# EAGLE design E4PRJ4PSU (EAGLE 7.1.0)
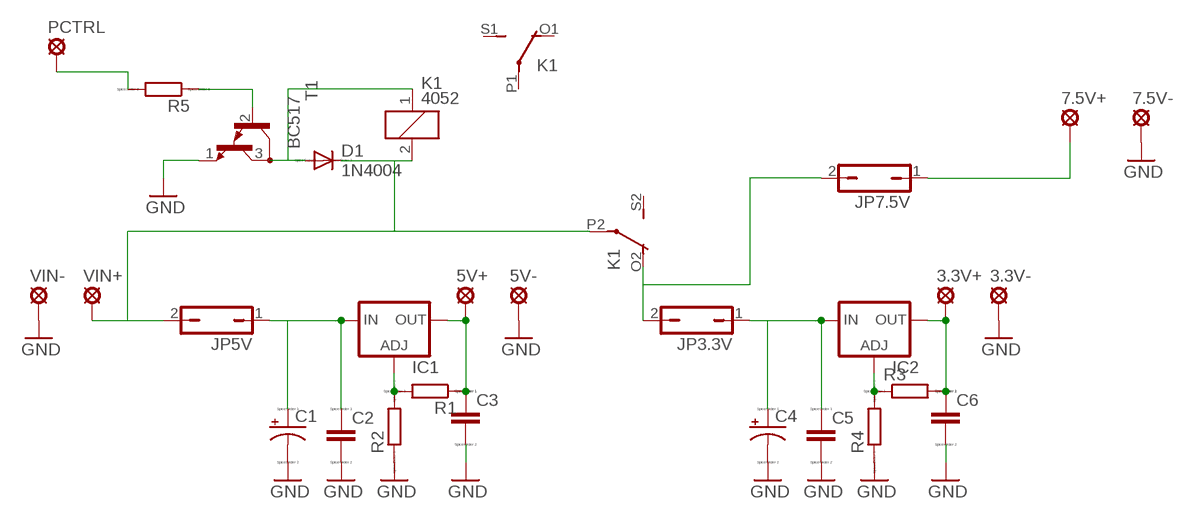
[diagram p0: schematic, sheet 1]

## Parts
3.3V+  SE14  [SE14]
3.3V-  SE14  [SE14]
5V+  SE14  [SE14]
5V-  SE14  [SE14]
7.5V+  SE14  [SE14]
7.5V-  SE14  [SE14]
C1  CPOL-USE5-10.5  [E5-10,5]
C2  C-EU050-025X075  [C050-025X075]
C3  C-EU050-025X075  [C050-025X075]
C4  CPOL-USE5-10.5  [E5-10,5]
C5  C-EU050-025X075  [C050-025X075]
C6  C-EU050-025X075  [C050-025X075]
D1  1N4004  [DO41-10]
IC1  LM317TS  [317TS]
IC2  LM317TS  [317TS]
JP3.3V  JP1Q  [JP1]
JP5V  JP1Q  [JP1]
JP7.5V  JP1Q  [JP1]
K1  4052  [F4052]
PCTRL  SE14  [SE14]
R1  R-EU_0207_10  [0207/10]
R2  R-EU_0207_10  [0207/10]
R3  R-EU_0207_10  [0207/10]
R4  R-EU_0207_10  [0207/10]
R5  R-EU_0207_10  [0207/10]
T1  BC517  [TO92]
VIN+  SE14  [SE14]
VIN-  SE14  [SE14]

## Nets
5V: JP3.3V.2 JP7.5V.2 K1.O2(3:O)
GND: 3.3V-.MP 5V-.MP 7.5V-.MP C1.- C2.2 C3.2 C4.- C5.2 C6.2 R2.1 R4.1 T1.1(E) VIN-.MP
N$1: C1.+ C2.1 IC1.3(IN) JP5V.1
N$2: 5V+.MP C3.1 IC1.2(OUT) R1.1
N$3: IC1.1(ADJ) R1.2 R2.2
N$4: C4.+ C5.1 IC2.3(IN) JP3.3V.1
N$5: IC2.1(ADJ) R3.1 R4.2
N$6: 3.3V+.MP C6.1 IC2.2(OUT) R3.2
N$8: PCTRL.MP R5.2
N$9: R5.1 T1.2(B)
N$10: D1.A K1.1 T1.3(C)
N$11: D1.C JP5V.2 K1.2 K1.P2(3:P) VIN+.MP
N$13: 7.5V+.MP JP7.5V.1
Unconnected: K1.O1(2:O) K1.P1(2:P) K1.S1(2:S) K1.S2(3:S)

## Library data of the parts
3.3V+ 3.3V- 5V+ 5V- 7.5V+ 7.5V- PCTRL VIN+ VIN- = solpad:SE14: SOLDER PAD E1553, drill 1,4mm, distributor Buerklin, 07F820
C1 C4 = resistor:CPOL-US: POLARIZED CAPACITOR, American symbol
C2 C3 C5 C6 = resistor:C-EU: CAPACITOR, European symbol; SPICEPREFIX: C
D1 = diode:1N4004: DIODE general purpose rectifier, 1 A
IC1 IC2 = v-reg:LM317TS: VOLTAGE REGULATOR
JP3.3V JP5V JP7.5V = jumper:JP1Q: JUMPER
K1 = relay:4052: RELAY 2 x switch, Finder; OC_FARNELL: unknown; OC_NEWARK: unknown
R1-R5 = resistor:R-EU_: RESISTOR, European symbol; SPICEPREFIX: R
T1 = transistor:BC517: NPN BIPOLAR DARLINGTON TRANSISTOR

## Net classes
0 default: width 0.305 mm, drill 0.508 mm, clearance 0.254 mm
1 IHA: width 0.406 mm, drill 2.159 mm, clearance 0.508 mm

## Board
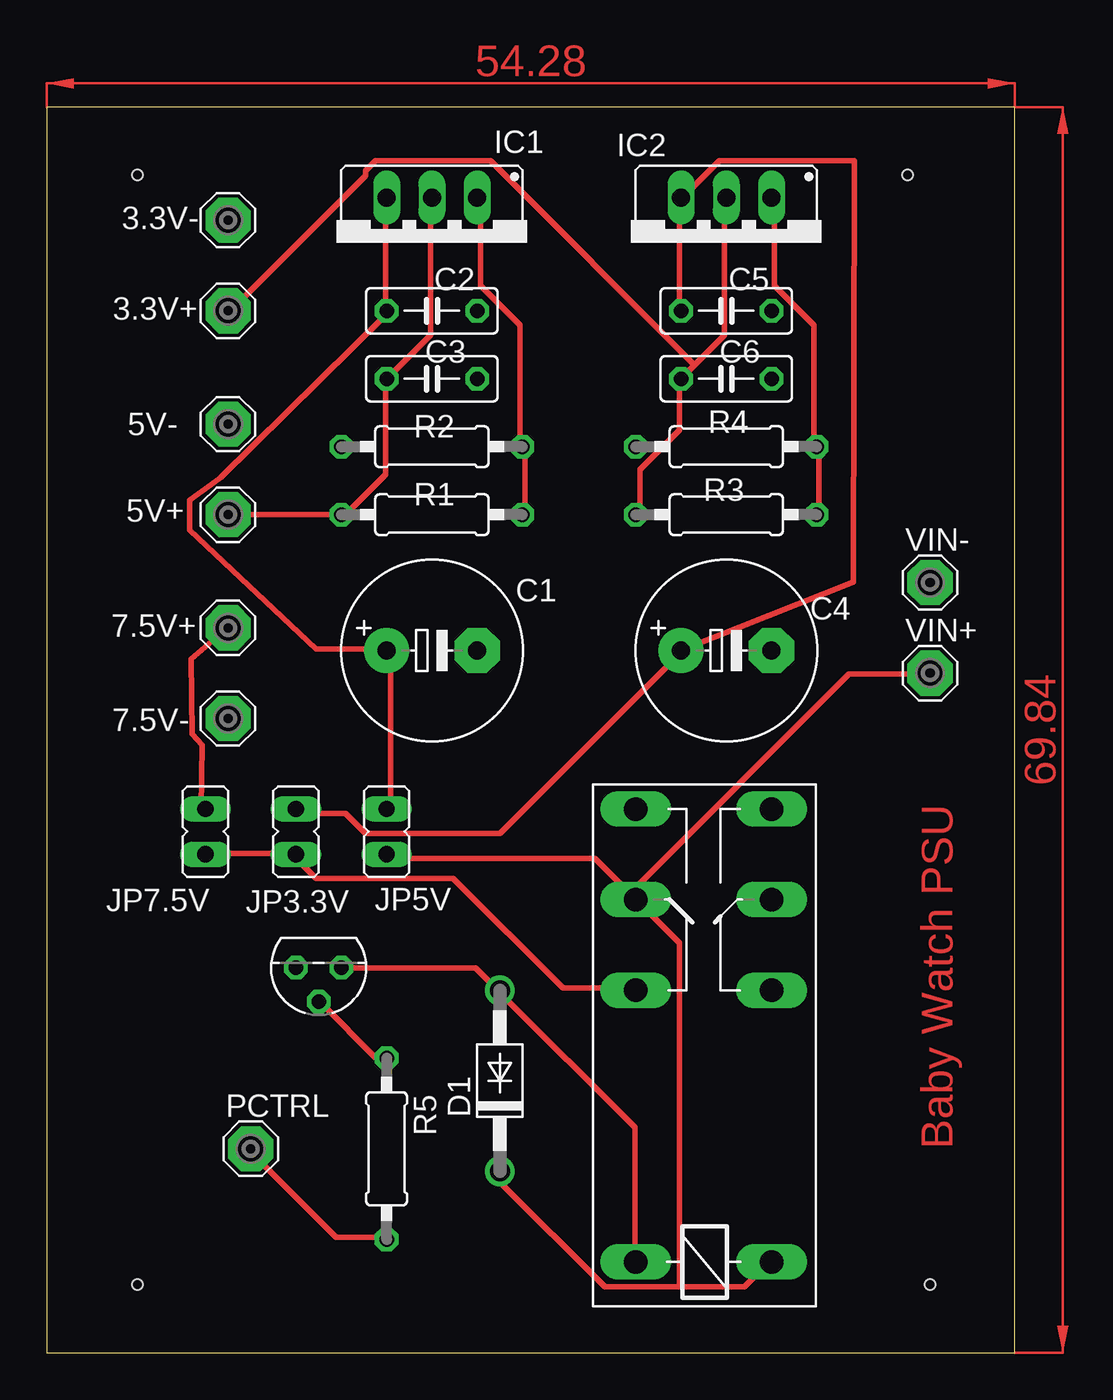
[diagram p1: board, top side]
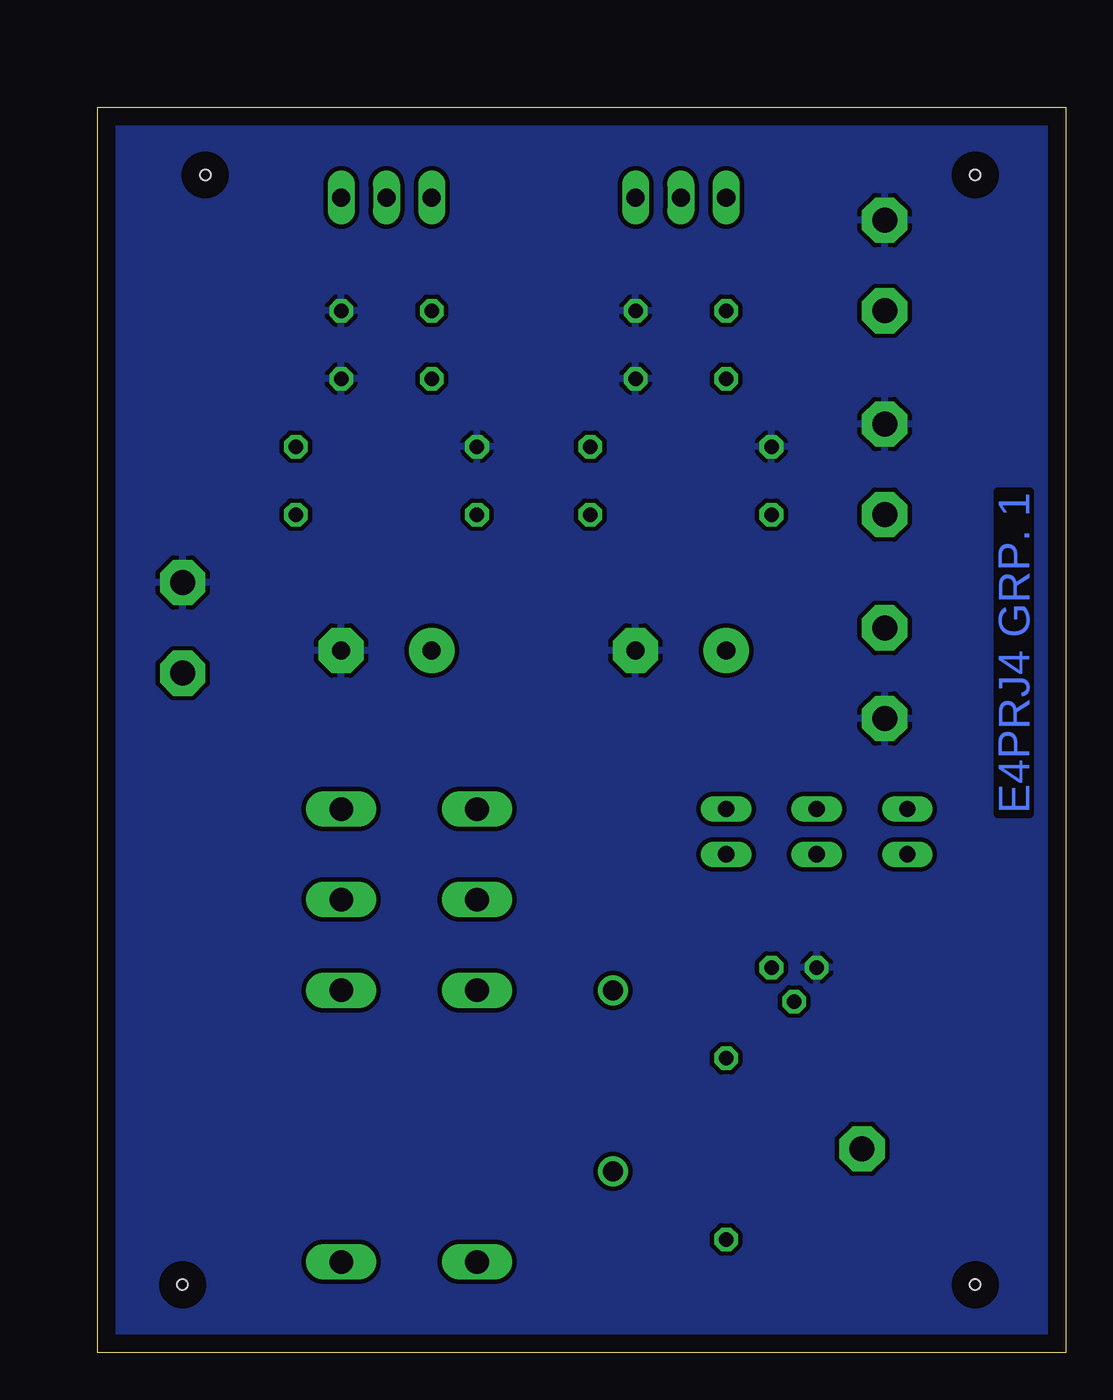
[diagram p2: board, bottom side, seen from below]

Size 54.28 x 69.84 mm. Coordinates in mm from the lower left corner, seen from the top.
Outline: 0,0 54.28,0 54.28,69.84 0,69.84 0,0
Copper layers (1*16): Top 0.035mm / dielectric 1.5mm / Bottom 0.035mm
Design rules "default": minimum track width 10mil, minimum drill 24mil, track to track 8mil, track to pad 8mil, pad to pad 8mil, via to via 8mil, smd to smd 8mil, copper to edge 40mil, drill to drill 8mil, minimum pad ring 10mil, minimum via ring 8mil, stop-mask expansion 4mil, vias tented up to drill 0mil, thermal gap 10mil
Holes 0.6 mm at 5.08,3.81 49.53,3.81 5.08,66.04 48.26,66.04

### Footprints (pad centres in the part's own frame; a part is rotated, then mirrored left to right if it is on the bottom)
SE14 = drill 1.397 pad 2.54 octagon: MP 0,0
E5-10,5 = drill 1.016 pad 2.54: + -2.54,0 | drill 1.016 pad 2.54 octagon: - 2.54,0
C050-025X075 = drill 0.813 octagon: 1 -2.54,0; 2 2.54,0
DO41-10 = drill 1.118: A 5.08,0; C -5.08,0
317TS = drill 1.016 long: 1 -2.54,-2.54; 2 0,-2.54; 3 2.54,-2.54
JP1 = drill 0.914 long: 1 0,-1.27; 2 0,1.27
F4052 = drill 1.321 long: 1 -3.81,3.81; 2 -3.81,-3.81; O1 11.43,-3.81; O2 11.43,3.81; P1 16.51,-3.81; P2 16.51,3.81; S1 21.59,-3.81; S2 21.59,3.81
0207/10 = drill 0.813 octagon: 1 -5.08,0; 2 5.08,0
TO92 = drill 0.813 octagon: 1 1.27,0; 2 0,1.905; 3 -1.27,0

### Placement (x,y rotation side)
3.3V+  10.16,58.42 0 top
3.3V-  10.16,63.5 0 top
5V+  10.16,46.99 0 top
5V-  10.16,52.07 0 top
7.5V+  10.16,40.64 0 top
7.5V-  10.16,35.56 0 top
C1  21.59,39.37 0 top
C2  21.59,58.42 0 top
C3  21.59,54.61 0 top
C4  38.1,39.37 0 top
C5  38.1,58.42 0 top
C6  38.1,54.61 0 top
D1  25.4,15.24 90 top
IC1  21.59,62.23 180 top
IC2  38.1,62.23 180 top
JP3.3V  13.97,29.21 180 top
JP5V  19.05,29.21 180 top
JP7.5V  8.89,29.21 180 top
K1  36.83,8.89 90 top
PCTRL  11.43,11.43 0 top
R1  21.59,46.99 0 top
R2  21.59,50.8 0 top
R3  38.1,46.99 180 top
R4  38.1,50.8 0 top
R5  19.05,11.43 270 top
T1  15.24,21.59 180 top
VIN+  49.53,38.1 0 top
VIN-  49.53,43.18 0 top

### Tracks (layer width: path | path; a pad name or v marks a point on that pad's centre or on a via)
5V
  Top 0.305: JP7.5V.2 8.94,27.99 13.97,27.99 JP3.3V.2 13.97,27.71 15.09,26.59 22.78,26.59 28.93,20.45 32.97,20.45 K1.O2
GND
  pour Bottom: -2.54,72.39 59.69,72.39 58.42,-3.81 -3.81,-3.81
N$1
  Top 0.305: IC1.3 19,64.59 19,58.44 C2.1 19,58.17 9.75,49.07 9.22,48.67 8,47.8 8,46.13 15.09,39.45 19,39.45 C1.+ 19.28,39.17 19.28,30.51 JP5V.1
N$2
  Top 0.305: 5V+.MP R1.1 16.76,46.99 19,49.23 19,54.53 C3.1 19.28,54.81 21.51,57.05 21.51,64.59 IC1.2
N$3
  Top 0.305: R1.2 26.82,46.99 26.82,50.62 R2.2 26.54,50.9 26.54,57.61 24.31,59.84 24.31,64.59 IC1.1
N$4
  Top 0.305: C5.1 35.48,58.44 35.48,64.59 IC2.3 35.76,64.87 37.72,66.83 45.29,66.83 45.24,43.2 35.76,39.45 C4.+ 35.48,39.17 25.42,29.11 17.88,29.11 16.76,30.23 13.97,30.23 JP3.3V.1
N$5
  Top 0.305: R3.1 43.31,46.99 43.31,50.62 R4.2 43.03,50.9 43.03,57.61 40.79,59.84 40.79,64.59 IC2.1
N$6
  Top 0.305: R3.2 33.25,46.99 33.25,49.51 35.48,51.74 35.48,54.53 C6.1 36.32,55.37 | 36.32,55.37 38,57.05 38,64.59 IC2.2 | 36.32,55.37 24.87,66.83 18.44,66.83 17.88,66.27 17.88,65.99 10.34,58.44 3.3V+.MP
N$8
  Top 0.305: R5.2 19,6.48 16.21,6.48 11.46,11.23 PCTRL.MP
N$9
  Top 0.305: R5.1 19,16.54 18.44,16.54 15.37,19.61 T1.2
N$10
  Top 0.305: T1.3 16.76,21.56 24.03,21.56 25.15,20.45 D1.A 25.42,20.17 32.97,12.62 32.97,5.08 K1.1
N$11
  Top 0.305: 35.48,3.68 39.12,3.68 40.51,5.08 K1.2 | 35.48,3.68 31.29,3.68 25.42,9.55 25.42,10.11 D1.C | 32.69,25.76 32.97,25.48 K1.P2 | 32.69,25.76 30.73,27.71 19.28,27.71 JP5V.2 | 32.69,25.76 44.98,38.05 49.45,38.05 VIN+.MP | 32.69,25.76 K1.P2 | 35.48,3.68 35.48,22.96 33.25,25.2 K1.P2
N$13
  Top 0.305: JP7.5V.1 8.66,30.51 8.71,34.06 8.15,34.7 8.1,38.89 10.06,40.56 7.5V+.MP
(copper drawn outside any net)
  shapes: Top area x2

### Text on the board
Top: Baby Watch PSU
Bottom: E4PRJ4 GRP. 1